# EAGLE design RobotPatient_BMI270 (EAGLE 9.6.2)
VERSION: v1.0 Sept 2022
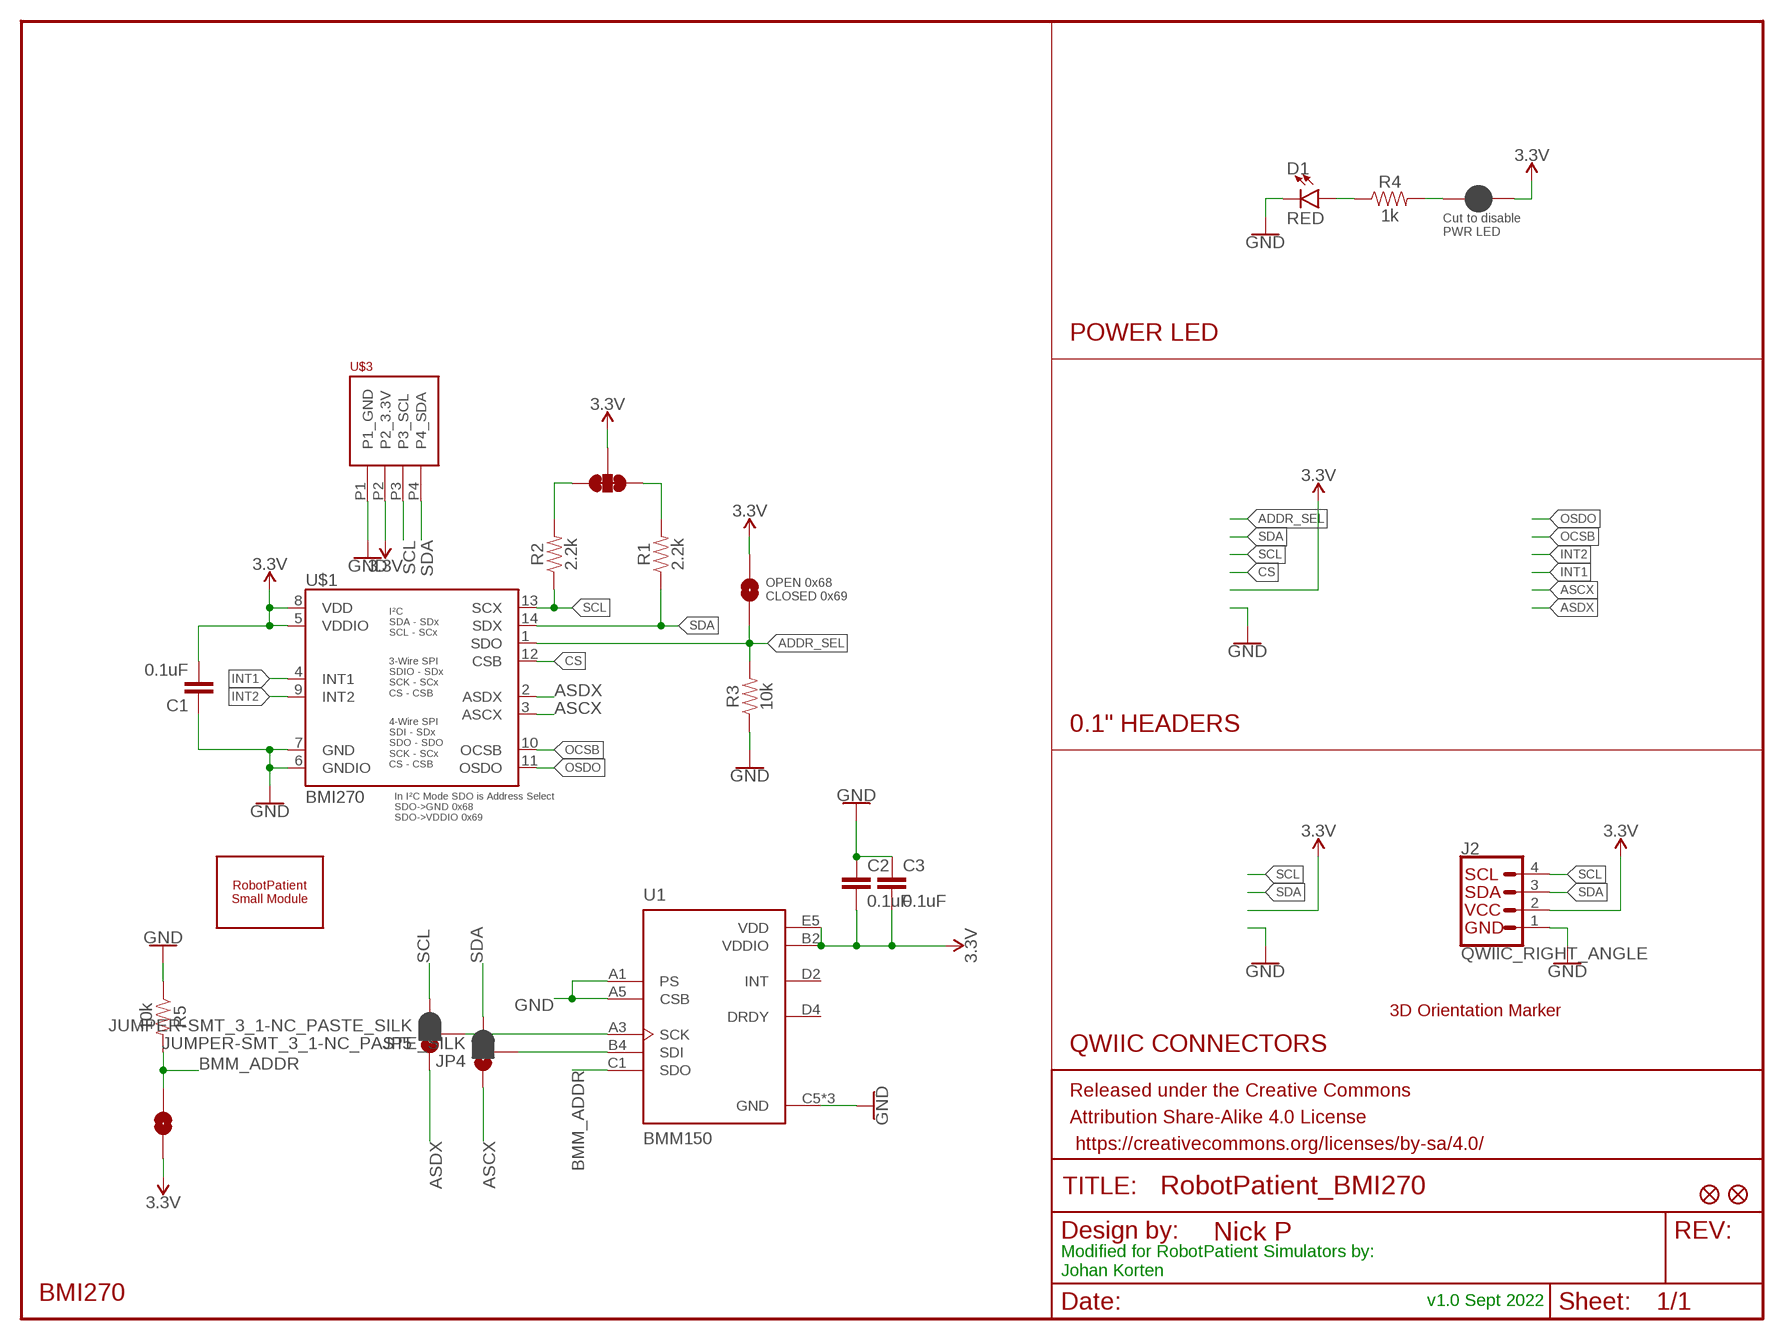
[diagram p0: schematic, sheet 1]

## Parts
C1  0.1uF  0.1UF-0603-25V-(+80/-20%)  [0603]
C2  0.1uF  0.1UF-0603-25V-(+80/-20%)  [0603]
C3  0.1uF  0.1UF-0603-25V-(+80/-20%)  [0603]
D1  RED  LED-RED0603  [LED-0603]
FD1  FIDUCIAL1X2  [FIDUCIAL-1X2]
FD2  FIDUCIAL1X2  [FIDUCIAL-1X2]
FRAME1  FRAME-LETTERNO_PACKAGE  [DUMMY]
J2  QWIIC_RIGHT_ANGLE  QWIIC_CONNECTORJS-1MM  [JST04_1MM_RA]
JP1  JUMPER-SMT_3_2-NC_TRACE_SILK  [SMT-JUMPER_3_2-NC_TRACE_SILK]
JP2  JUMPER-SMT_2_NO_SILK  [SMT-JUMPER_2_NO_SILK]
JP3  JUMPER-SMT_2_NC_PASTE_SILK  [SMT-JUMPER_2_NC_PASTE_SILK]
JP4  JUMPER-SMT_3_1-NC_PASTE_SILK  [SMT-JUMPER_3_1-NC_PASTE_SILK]
JP5  JUMPER-SMT_3_1-NC_PASTE_SILK  [SMT-JUMPER_3_1-NC_PASTE_SILK]
JP6  JUMPER-SMT_2_NO_SILK  [SMT-JUMPER_2_NO_SILK]
R1  2.2k  2.2KOHM-0603-1/10W-1%  [0603]
R2  2.2k  2.2KOHM-0603-1/10W-1%  [0603]
R3  10k  10KOHM-0603-1/10W-1%  [0603]
R4  1k  1KOHM-0603-1/10W-1%  [0603]
R5  10k  10KOHM-0603-1/10W-1%  [0603]
U1  BMM150  [XDCR_BMM150]
U$1  BMI270  [BMI270]
U$2  3D_MARKER  [3D_MARKER]
U$3  PHOENIX_PTSM_M4_THANGLE  [PTSM_M4_TH]
U$40  ROBOTPATIENT_SMALL_MODULEBOARD  [RP_SMALL_SENSOR_OUTLINE]

## Nets
3.3V: C1.2 C2.2 C3.2 J2.2 JP1.2 JP2.2 JP3.2 JP6.2 U1.B2(VDDIO) U1.E5(VDD) U$1.5(VDDIO) U$1.8(VDD) U$3.P2(P2_3.3V)
ADDR_SEL: JP2.1 R3.2 U$1.1(SDO)
ASCX: JP4.1 U$1.3(ASCX)
ASDX: JP5.1 U$1.2(ASDX)
BMM_ADDR: JP6.1 R5.2 U1.C1(SDO)
CS: U$1.12(CSB)
GND: C1.1 C2.1 C3.1 D1.C J2.1 R3.1 R5.1 U1.A1(PS) U1.A5(CSB) U1.C5(GND) U1.E1(GND) U1.E3(GND) U$1.6(GNDIO) U$1.7(GND) U$3.P1(P1_GND)
INT1: U$1.4(INT1)
INT2: U$1.9(INT2)
N$1: JP1.1 R1.2
N$2: JP1.3 R2.2
N$3: JP3.1 R4.2
N$4: D1.A R4.1
N$5: JP4.2 U1.B4(SDI)
N$6: JP5.2 U1.A3(SCK)
OCSB: U$1.10(OCSB)
OSDO: U$1.11(OSDO)
SCL: J2.4 JP5.3 R2.1 U$1.13(SCX) U$3.P3(P3_SCL)
SDA: J2.3 JP4.3 R1.1 U$1.14(SDX) U$3.P4(P4_SDA)
Unconnected: U1.D2(INT) U1.D4(DRDY)

## Notes on the sheet
- Cut to disable 
  PWR LED
- POWER LED
- OPEN 0x68
  CLOSED 0x69
- 0.1" HEADERS
- QWIIC CONNECTORS
- Modified for RobotPatient Simulators by:
  Johan Korten
- BMI270

## Library data of the parts
C1-C3 = SparkFun-Capacitors:0.1UF: 0.1µF ceramic capacitors A capacitor is a passive two-terminal electrical component used to store electrical energy temporarily in an electric field.; PROD_ID: CAP-00810
D1 = SparkFun-LED:LED-RED: Red SMD LED Used in manufacturing of most products at SparkFun Packages: 0603 - SMD 0603 package [Product Link] <http://docs.avagotech.com/docs/AV02-0551EN> 0603 SMART - SMD 0603 SMART package ( more efficient and expensive)[Product Link] <http://www.osram-os.com/Graphics/XPic2/00077099_0.pdf> 1206 - SMD1206 package [Product Link] <https://www.sparkfun.com/datasheets/DevTools/LilyPad/Q150OVS4.pdff> SparkFun Products: Pro Mini 328 -5V <https://www.sparkfun.com/products/821> RedBoard <https://www.sparkfun.com/products/12757> IOIO-OTG <https://www.sparkfun.com/products/13613>; PROD_ID: DIO-00819
FD1 FD2 = SparkFun-Aesthetics:FIDUCIAL: Fiducial Alignment Points Point-of-reference for pick-and-place machines and other optical instruments.
FRAME1 = SparkFun-Aesthetics:FRAME-LETTER: Schematic Frame - Letter Standard 8.5x11 US Letter frame; DESIGNER: Nick P; VERSION: 1.0 Sep 22
J2 = SparkFun-Connectors:QWIIC_CONNECTOR: SparkFun I2C Standard Qwiic Connector An SMD 1mm pitch JST connector makes it easy and quick (get it? Qwiic?) to connect I2C devices to each other. The Qwiic system <http://www.sparkfun.com/qwiic> enables fast and solderless connection between popular platforms and various sensors and actuators. We carry 200mm <https://www.sparkfun.com/products/14204>, 100mm <https://www.sparkfun.com/products/14205>, 50mm <https://www.sparkfun.com/products/14206>, and breadboard friendly <https://www.sparkfun.com/products/14207> Qwiic cables. We also offer 10 pcs strips <https://www.sparkfun.com/products/14323> the SMD connectors.; PROD_ID: CONN-13694
JP1 = SparkFun-Jumpers:JUMPER-SMT_3_2-NC_TRACE: Normally closed trace jumper (2 of 2 connections) This jumper has a trace between all three pads so they are normally closed (NC). Use a razor knife to open the connection(s). For best results follow the IPC guidelines for cutting traces: Cutout at least 0.063 mm (0.005 in). Remove all loose material to clean up the cut area. Seal the cut with an approved epoxy. Reapply solder to reclose the connection(s).
JP2 JP6 = SparkFun-Jumpers:JUMPER-SMT_2_NO: Normally open jumper This jumper has two pads in close proximity to each other. Apply solder to close the connection. Round pads are easier to solder for beginners, but are a lot larger. SparkFun Product that uses the round pads: SparkFun EL Sequencer <https://www.sparkfun.com/products/12781>
JP3 = SparkFun-Jumpers:JUMPER-SMT_2_NC_PASTE: Normally closed solder jumper This jumper has an aperture in the stencil to allow solder paste to bridge the split in the wire so it's normally closed (NC). Wick off the solder to open the connection. Reapply solder to reclose the connection.
JP4 JP5 = SparkFun-Jumpers:JUMPER-SMT_3_1-NC_PASTE: Normally closed solder jumper (1 of 2 connections) This jumper has an aperture in the stencil to allow solder paste to bridge one of the two connections. One connection is normally closed (NC), while the other is normally open (NO). Wick off the solder to open the connection. Reapply solder to reclose the connection. Apply solder to the other side instead to change the current path.
R1 R2 = SparkFun-Resistors:2.2KOHM: 2.2kΩ resistor A resistor is a passive two-terminal electrical component that implements electrical resistance as a circuit element. Resistors act to reduce current flow, and, at the same time, act to lower voltage levels within circuits. - Wikipedia; PROD_ID: RES-08272
R3 R5 = SparkFun-Resistors:10KOHM: 10kΩ resistor A resistor is a passive two-terminal electrical component that implements electrical resistance as a circuit element. Resistors act to reduce current flow, and, at the same time, act to lower voltage levels within circuits. - Wikipedia; PROD_ID: RES-00824
R4 = SparkFun-Resistors:1KOHM: 1kΩ resistor A resistor is a passive two-terminal electrical component that implements electrical resistance as a circuit element. Resistors act to reduce current flow, and, at the same time, act to lower voltage levels within circuits. - Wikipedia; PROD_ID: RES-07856
U1 = BMM150:BMM150: BMM150 Series 3.6 V Surface Mount Three-Axis Geomagnetic Sensor - WLCSP-12 Check availability <https://pricing.snapeda.com/parts/BMM150/Bosch%20Sensortec/view-part?ref=eda>; AVAILABILITY: In Stock; DESCRIPTION: FlipCore, Hall Effect Sensor X, Y, Z Axis 12-WLCSP (1.56x1.56); MF: Bosch Sensortec; MP: BMM150; PACKAGE: WLCSP-12 Bosch; PRICE: None; PURCHASE-URL: https://pricing.snapeda.com/search/part/BMM150/?ref=eda
U$1 = SparkFun-Sensors:BMI270
U$2 = jk_customs:3D_MARKER
U$3 = jk_customs:PHOENIX_PTSM_M4_TH
U$40 = jk_customs:ROBOTPATIENT_SMALL_MODULE

## Board
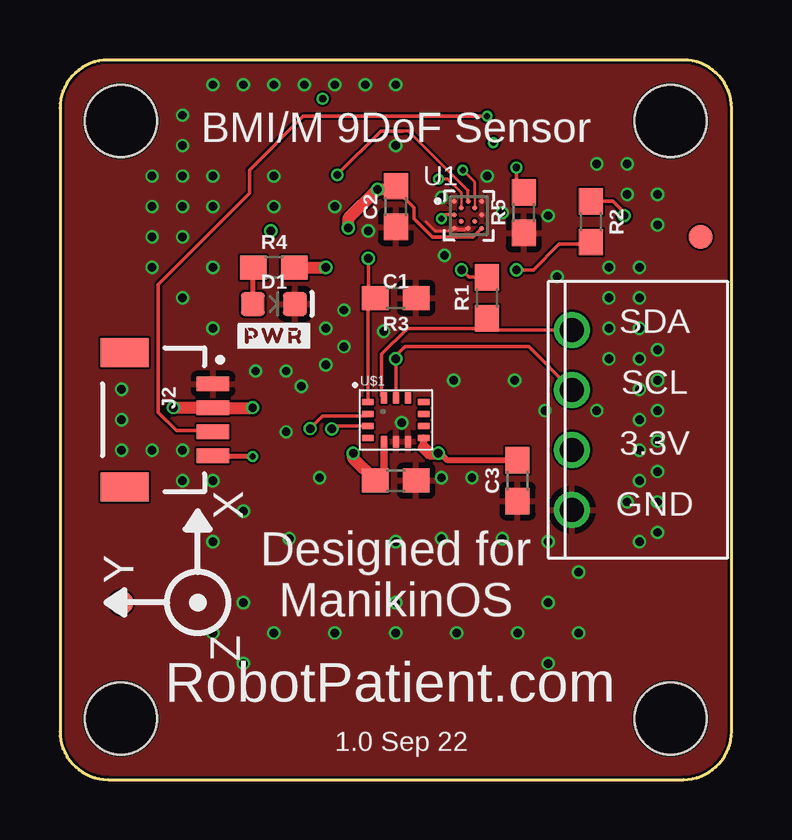
[diagram p1: board, top side]
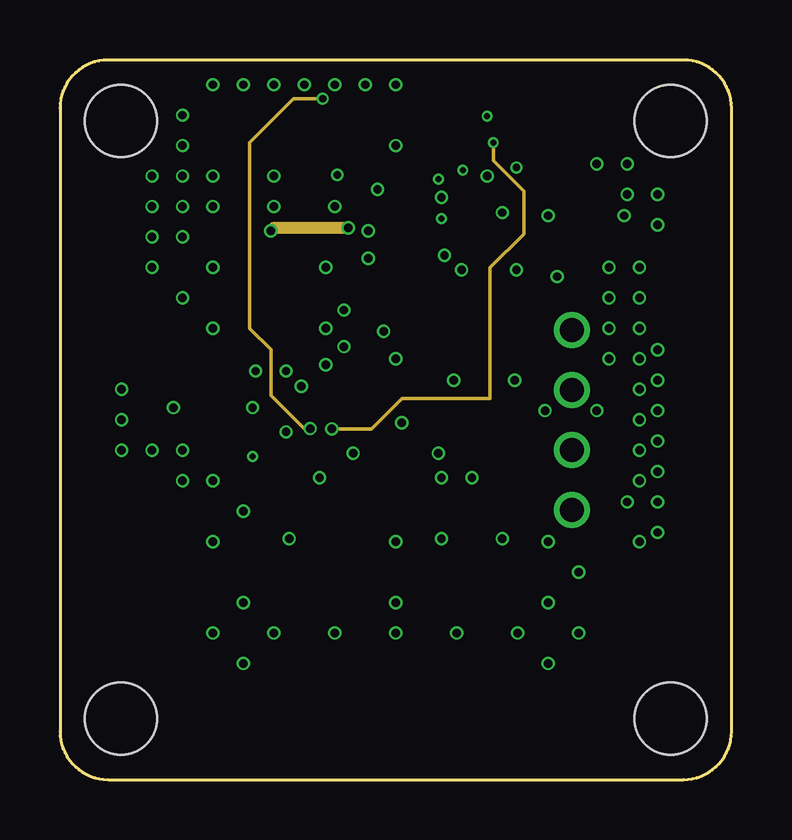
[diagram p2: board, inner layer Route2]
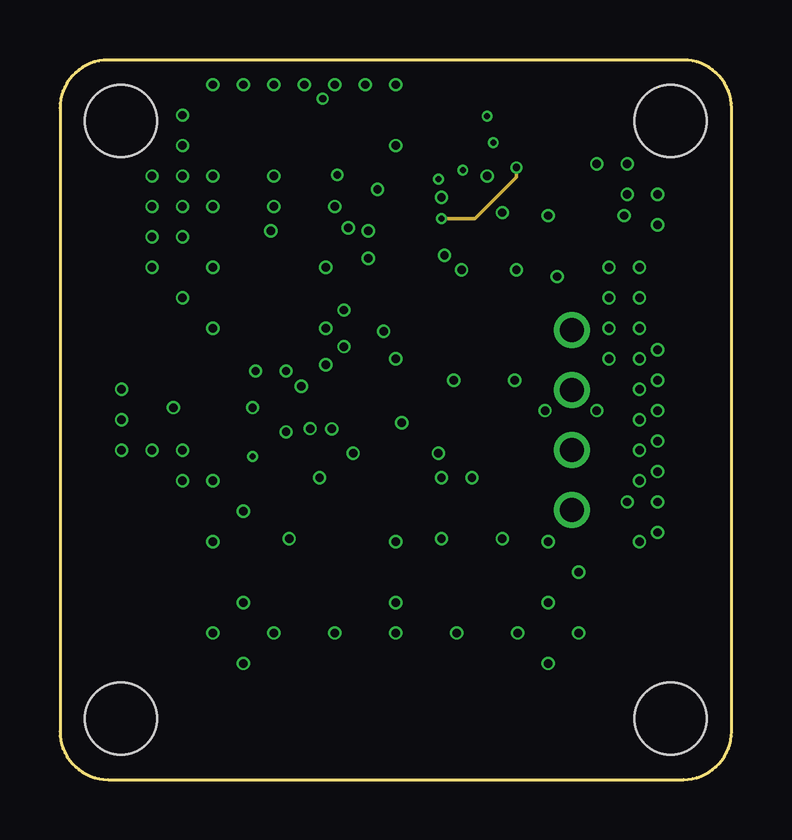
[diagram p3: board, inner layer Route3]
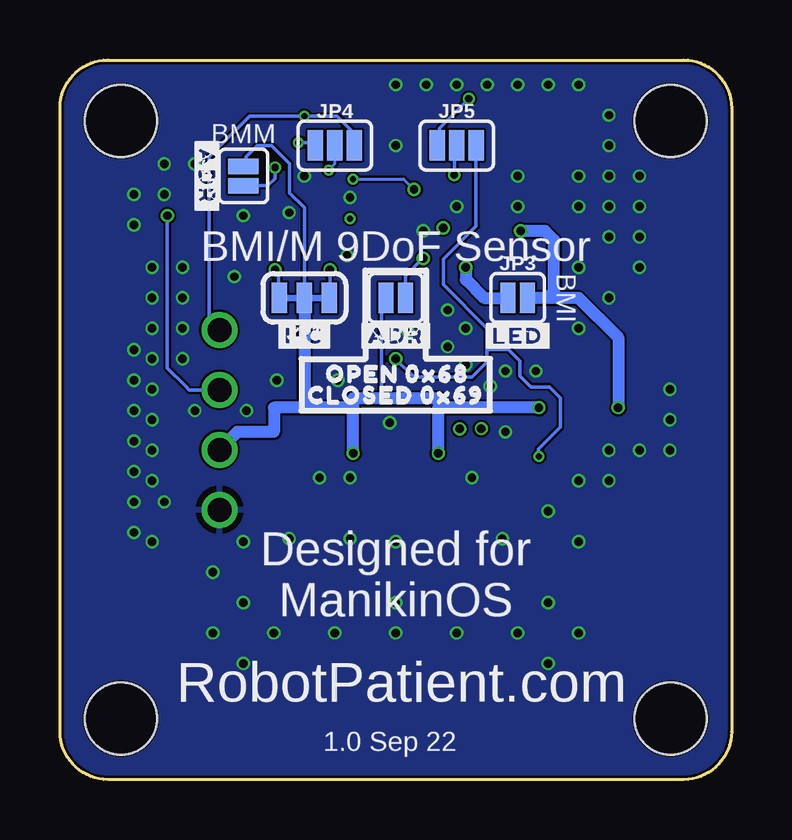
[diagram p4: board, bottom side, seen from below]

Size 28 x 30 mm. Coordinates in mm from the lower left corner, seen from the top.
Copper layers (1+2*3+16): Top 0.035mm / dielectric 0.2mm / Route2 0.0175mm / dielectric 1.065mm / Route3 0.0356mm / dielectric 0.2007mm / Bottom 0.035mm
Design rules "jlcpcb-4-layer_JLC7628-stackup": minimum track width 3.5mil, minimum drill 0.2mm, track to track 3.5mil, track to pad 5mil, pad to pad 5mil, via to via 5mil, smd to smd 0mil, copper to edge 0.1mm, drill to drill 5mil, minimum pad ring 4mil, minimum via ring 4mil, stop-mask expansion 3mil, vias tented up to drill 100mil, thermal gap 10mil

### Footprints (pad centres in the part's own frame; a part is rotated, then mirrored left to right if it is on the bottom)
0603 = smd 1.1 x 1: 1 -0.85,0; 2 0.85,0
LED-0603 = smd 1 x 1: A -0.877,0; C 0.877,0
FIDUCIAL-1X2 = smd 1 x 1: 1 0,0
JST04_1MM_RA = smd 0.6 x 1.35: 1 -1.5,0; 2 -0.5,0; 3 0.5,0; 4 1.5,0 | smd 1.2 x 2: NC1 2.8,-3.675; NC2 -2.8,-3.675
SMT-JUMPER_3_2-NC_TRACE_SILK = smd 0.66 x 1.27: 1 -1.041,0; 2 0,0; 3 1.041,0
SMT-JUMPER_2_NO_SILK = smd 0.635 x 1.27: 1 -0.406,0; 2 0.406,0
SMT-JUMPER_2_NC_PASTE_SILK = smd 0.635 x 1.27: 1 -0.406,0; 2 0.406,0
SMT-JUMPER_3_1-NC_PASTE_SILK = smd 0.635 x 1.27: 1 -0.813,0; 2 0,0; 3 0.813,0
XDCR_BMM150 = smd 0.2 x 0.2: A1 -0.601,0.601; A3 -0.035,0.601; A5 0.531,0.601; B2 -0.318,0.318; B4 0.248,0.318; C1 -0.601,0.035; C5 0.531,0.035; D2 -0.318,-0.248; D4 0.248,-0.248; E1 -0.601,-0.531; E3 -0.035,-0.531; E5 0.531,-0.531
BMI270 = smd 0.475 x 0.25: 1 -1.163,0.748; 2 -1.163,0.247; 3 -1.163,-0.253; 4 -1.163,-0.752; 8 1.163,-0.75; 9 1.163,-0.25; 10 1.163,0.25; 11 1.163,0.75 | smd 0.25 x 0.475: 5 -0.497,-0.912; 6 0.003,-0.912; 7 0.502,-0.912; 12 0.502,0.91; 13 0.003,0.91; 14 -0.497,0.91
PTSM_M4_TH = drill 1: P1 3.75,1; P2 1.25,1; P3 -1.25,1; P4 -3.75,1
RP_SMALL_SENSOR_OUTLINE = hole 3: -11.455,12.455; 11.455,12.455; 11.455,-12.455; -11.455,-12.455

### Placement (x,y rotation side)
C1  14,12.46 180 top
C2  14,23.89 90 top
C3  19.08,12.46 90 top
D1  8.92,19.83 0 top
FD1  2.57,7.38 0 top
FD2  26.7,22.62 0 top
FRAME1  1.3,2.3 0 top
J2  6.38,15 270 top
JP1  17.81,20.08 180 bottom
JP2  14,20.08 180 bottom
JP3  8.92,20.08 0 bottom
JP4  16.54,26.43 0 bottom
JP5  11.46,26.43 0 bottom
JP6  20.35,25.16 90 bottom
R1  17.81,20.08 90 top
R2  22.13,23.26 270 top
R3  14,20.08 180 top
R4  8.92,21.35 0 top
R5  19.33,23.64 90 top
U1  17.05,23.51 0 top
U$1  14,15 0 top
U$2  5.74,7.38 90 top
U$3  20.35,15 270 top
U$4  [#ADR#2713]  21.87,25.16 270 bottom
U$18  [#PWR#2711]  8.92,18.5 0 top
U$21  [#I�C#2714]  17.81,18.5 0 bottom
U$22  [#LED#2712]  8.92,18.5 0 bottom
U$23  [#ADR#2713]  14,18.5 0 bottom
U$24  [OPEN_0X682714]  17.43,16.91 0 bottom
U$25  [CLOSED_0X692714]  18.19,16.02 0 bottom
U$40  14,15 0 top

### Tracks (layer width: path | path; a pad name or v marks a point on that pad's centre or on a via)
3.3V  (via drill 0.25, 0.35)
  Top 0.1: U1.B2 16.73,24.46
  Top 0.127: v15.78,25.03 16.16,25.03 16.73,24.46
  Top 0.152: 13.5,12.46 C1.2 | J2.2 | 14,24.6 14.76,23.84 14.76,23.38 15.52,22.62 17.22,22.62 U1.E5 | v13.24,24.6 14,24.6 | 14,24.6 C2.2 | v15.78,13.6 15.85,13.6 | C3.2 18.97,13.31 18.95,13.32
  Top 0.254: 18.95,13.32 16.13,13.32 15.85,13.6
  Top 0.305: U$1.5 13.5,12.46 | U$1.8 15.16,13.84
  Top 0.508: v4.73,15.51 J2.2 | J2.2 v8.02,15.5 v8.03,15.51 | C1.2 12.22,13.39 v12.22,13.6 | v15.78,13.6 15.4,13.6 15.16,13.84 | v12.02,23 12.02,23.38 v13.24,24.6 13.86,24.6 C2.2
  Route2 0.508: v8.79,22.87 8.92,23 v12.02,23
  Bottom 0.127: v15.78,25.03 13.67,25.03 v13.24,24.6
  Bottom 0.152: 14.58,15.89 14.58,19.9 JP2.2 | JP1.2 17.81,23.84 18.42,24.45 18.42,25.67 19.18,26.43 19.79,26.43 20.25,25.97 20.25,25.67 JP6.2
  Bottom 0.203: 12.22,15.51 12.22,15.89
  Bottom 0.508: v4.73,15.51 4.73,18.43 6.38,20.08 7.65,20.08 | v8.03,15.51 12.22,15.51 v12.22,13.6 | 12.22,15.89 14.58,15.89 15.78,15.89 15.78,15.51 | 15.78,15.51 17.81,15.51 | 17.81,15.51 19.08,15.51 19.08,14.49 20.61,14.49 U$3.P2 | v15.78,13.6 15.78,15.51 | JP1.2 17.81,15.51 | 7.65,20.08 JP3.2 | 7.65,20.08 7.4,20.33 7.4,22.49 7.78,22.87 v8.79,22.87
ADDR_SEL  (via drill 0.35)
  Top 0.152: U$1.1 12.84,20.08 R3.2 12.86,20.37 v12.86,21.73
  Bottom 0.152: v12.86,21.73 13.59,20.99 JP2.1
ASCX  (via drill 0.25, 0.35)
  Top 0.152: U$1.3 11.46,14.75 v11.33,14.62
  Route2 0.152: v18.06,26.56 18.06,25.8 19.33,24.52 19.33,22.75 17.94,21.35 17.94,15.89 14.25,15.89 12.98,14.62 v11.33,14.62
  Bottom 0.152: JP4.1 17.48,26.56 v18.06,26.56
ASDX  (via drill 0.3, 0.35)
  Top 0.152: v10.43,14.63 10.95,15.15 12.78,15.15 12.84,15.21 U$1.2
  Route2 0.152: v10.95,28.39 9.73,28.39 7.9,26.56 7.9,18.81 8.79,17.92 8.79,16.02 10.18,14.63 v10.43,14.63
  Bottom 0.152: v10.95,28.39 12.17,27.17 12.17,26.43 JP5.1
BMM_ADDR  (via drill 0.25, 0.3)
  Top 0.152: v15.9,23.38 16.07,23.54 U1.C1 | R5.2 19.03,24.79 v19.03,25.52
  Route3 0.152: v15.9,23.38 17.3,23.38 19.03,25.11 v19.03,25.52
  Bottom 0.152: JP6.1 19.33,24.75 19.03,25.06 v19.03,25.52
GND  (via drill 0.35)
  Top 0.127: U1.E1 16.34,22.87 15.65,22.87 15.27,23.26
  Top 0.152: U1.E3 16.91,22.98 16.87,22.93 16.59,22.93 16.55,22.98 U1.E1
  other vias: 14,9.92 14,7.38 20.35,9.92 20.35,7.38 11.08,18.81 11.08,17.29 3.84,22.62 3.84,21.35 3.84,25.16 6.38,18.81 6.38,21.35 3.84,23.89 5.11,25.16 6.38,25.16 5.11,23.89 3.84,13.73 7.65,11.19 9.43,14.49 9.43,17.03 8.16,17.03 5.11,26.43 5.11,27.7 6.38,28.97 7.65,28.97 8.92,28.97 10.19,28.97 11.46,28.97 12.73,28.97 2.57,15 2.57,16.27 5.11,13.73 5.11,12.46 6.38,12.46 2.57,13.73 5.11,22.62 5.11,20.08 8.92,25.16 8.92,23.89 6.38,23.89 11.46,23.89 14,26.43 24.16,21.35 22.89,21.35 22.89,20.08 22.89,18.81 24.16,20.08 24.16,18.81 24.16,17.54 24.16,16.27 22.89,17.54 21.62,8.65 17.18,12.59 15.9,12.59 18.95,16.65 16.41,16.65 20.22,15.38 22.38,15.38 24.92,15.38 24.16,13.73 24.92,12.84 24.92,11.57 24.16,12.46 24.16,15 24.92,14.11 24.92,16.65 24.92,17.92 23.65,11.57 24.16,9.92 24.92,10.3 10.82,12.59 9.55,10.05 14.25,14.87 11.84,18.05 11.84,19.57 13.49,18.68 20.73,20.97 16.03,21.86 22.38,25.67 23.65,25.67 23.65,24.4 24.92,24.4 24.92,23.13 14,28.97 18.45,10.05 15.9,10.05 17.81,25.16 18.45,23.64 20.35,23.51 12.86,22.87 15.9,24.27 10.06,16.4 21.62,6.11 20.35,4.84 19.08,6.11 16.54,6.11 14,6.11 11.46,6.11 8.92,6.11 7.65,7.38 6.38,6.11 7.65,4.84 6.38,9.92
  pour Top: -3.78,-1.51 33.05,-1.51 33.05,31.51 -3.78,31.51
  pour Bottom: -2.51,-2.78 30.51,-2.78 30.51,34.05 -2.51,34.05
N$1  (via drill 0.35)
  Top 0.152: v16.74,21.25 17.05,20.94 17.81,20.94 R1.2
  Bottom 0.152: JP1.1 16.74,20.11 v16.74,21.25
N$2  (via drill 0.35)
  Top 0.152: v19.03,21.25 19.74,21.25 20.81,22.32 22.04,22.32 R2.2
  Bottom 0.152: v19.03,21.25 18.88,21.1 18.88,20.11 JP1.3
N$3  (via drill 0.35)
  Top 0.508: R4.2 v11.08,21.35
  Bottom 0.508: v11.08,21.35 11.08,20.84 10.32,20.08 JP3.1
N$4
  Top 0.203: D1.A 8.04,21.32 R4.1
N$5  (via drill 0.25)
  Top 0.102: U1.B4 17.3,24.39
  Top 0.127: 17.3,24.39 17.3,24.4 17.3,24.91 v16.79,25.41
  Bottom 0.127: v16.79,25.41 16.54,25.67 JP4.2
N$6  (via drill 0.3)
  Top 0.127: U1.A3 17.01,24.56 14.53,27.04 14.3,27.04
  Top 0.152: 14.3,27.04 13.39,27.04 v11.56,25.21
  Bottom 0.152: v11.56,25.21 11.56,26.43 JP5.2
SCL  (via drill 0.25, 0.35)
  Top 0.152: U$1.13 v14,17.54 14,17.67 14.38,18.05 19.55,18.05 U$3.P3 | 8.01,13.5 v8.03,13.48 | R2.1 23.06,24.11 23.52,23.64 v23.52,23.51
  Top 0.2: J2.4 8.01,13.5
  Bottom 0.152: v23.52,23.51 23.52,17.16 22.79,16.42 22.62,16.25 U$3.P3 | JP5.3 10.65,23.08 12.02,21.71 12.02,20.64 10.19,18.81 10.19,17.92 | v8.03,13.48 8.06,13.48 8.06,13.78 7.14,14.7 7.14,15.91 7.6,16.37 8.36,16.37 8.82,16.83 8.82,17.44 9.3,17.92 10.19,17.92 | 10.19,17.92 10.19,17.41 10.82,16.78 13.24,16.78 v14,17.54
SDA  (via drill 0.25)
  Top 0.152: U$1.14 13.42,16 13.42,17.74 14.48,18.81 17.81,18.81 17.96,18.96 17.81,19.12 R1.1 18.29,18.75 U$3.P4 | J2.3 6.38,14.54 4.86,14.54 4.09,15.3 4.09,20.64 7.9,24.45 7.9,25.41 10.14,27.65 v17.81,27.65
  Bottom 0.152: JP4.3 15.83,26.43 15.83,27.04 16.44,27.65 v17.81,27.65 20.1,27.65 21.77,25.97 21.77,19.17 U$3.P4

### Text on the board
_tsilk: Designed for / ManikinOS | RobotPatient.com
_bsilk: BMM | BMI | Designed for / ManikinOS | RobotPatient.com